# Altium schematic sheet Hardwiring.SchDoc
size 594 x 420 mm; Address1: Address1; Address2: Address2; Address3: Address3; Address4: Address4; DocumentNumber: *Э3; SheetNumber: 10; SheetTotal: 11; DocumentType: Схема электрическая *
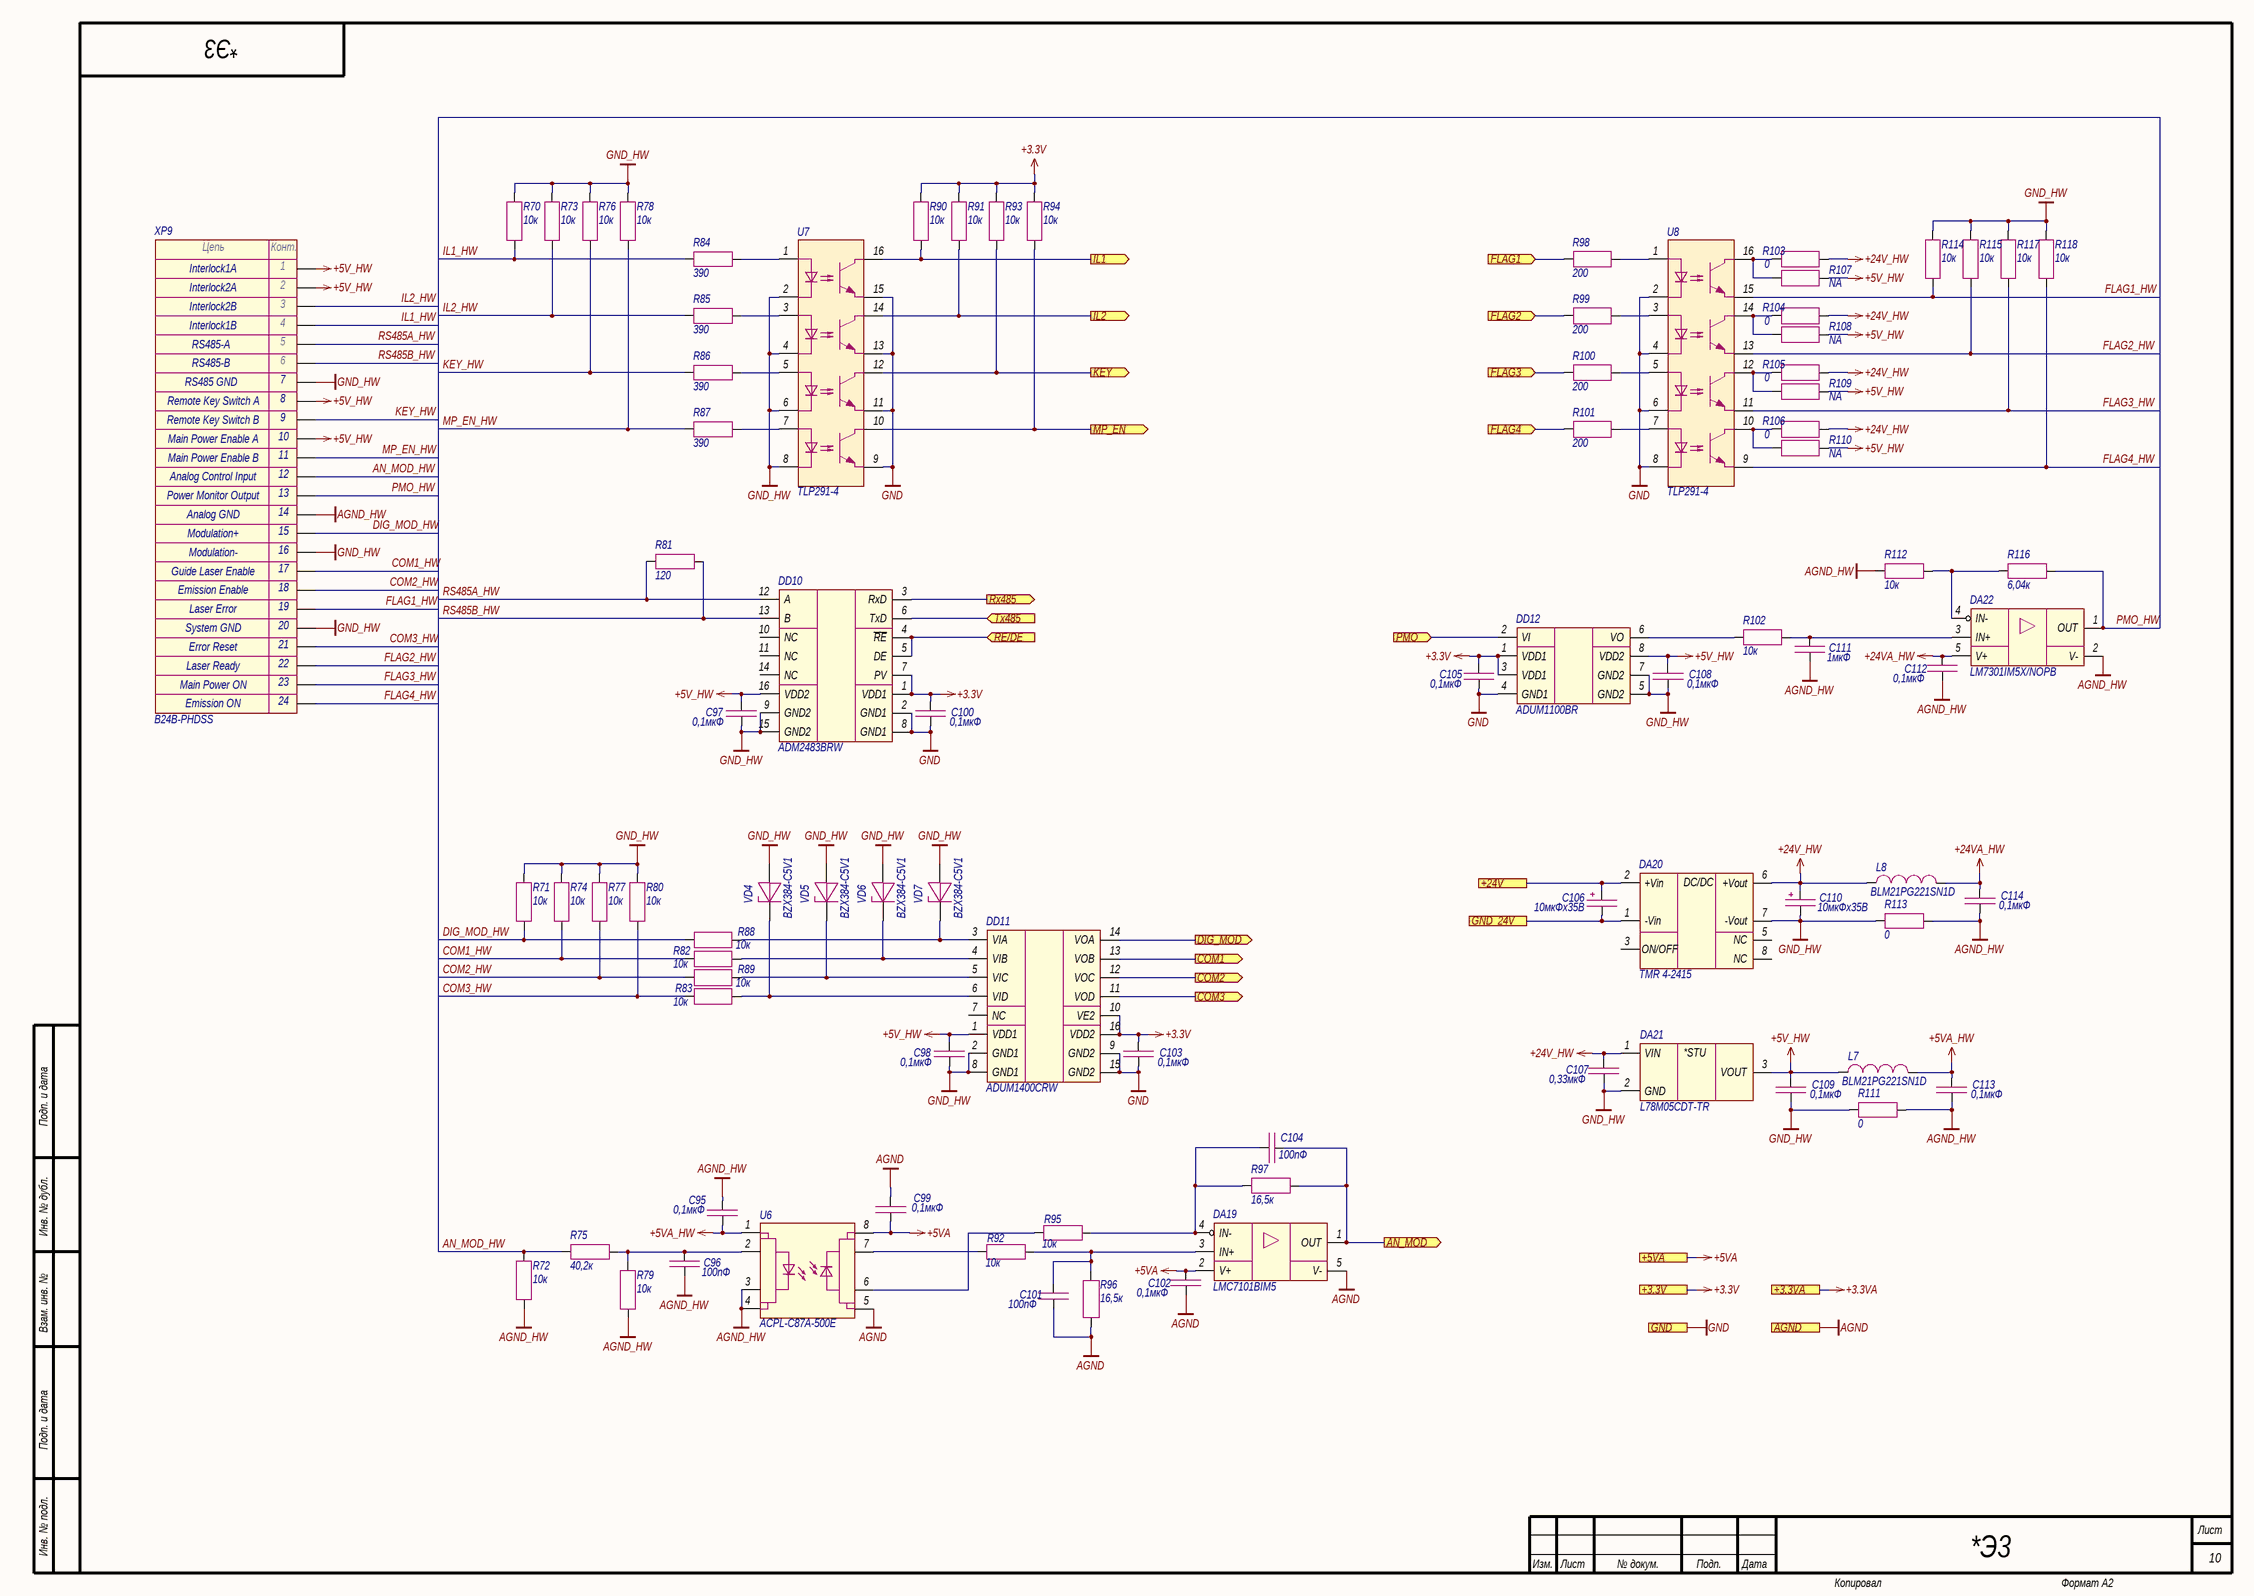
[diagram p0: Hardwiring.SchDoc]

## Parts
C95  0,1мкФ  [CAP_0603]
C96  100пФ  [CAP_0603]
C97  0,1мкФ  [CAP_0603]
C98  0,1мкФ  [CAP_0603]
C99  0,1мкФ  [CAP_0603]
C100  0,1мкФ  [CAP_0603]
C101  100пФ  [CAP_0603]
C102  0,1мкФ  [CAP_0603]
C103  0,1мкФ  [CAP_0603]
C104  100пФ  [CAP_0603]
C105  0,1мкФ  [CAP_0603]
C106  10мкФх35B  [CAP_C]
C107  0,33мкФ  [CAP_0805]
C108  0,1мкФ  [CAP_0603]
C109  0,1мкФ  [CAP_0603]
C110  10мкФх35B  [CAP_C]
C111  1мкФ  [CAP_0603]
C112  0,1мкФ  [CAP_0603]
C113  0,1мкФ  [CAP_0603]
C114  0,1мкФ  [CAP_0603]
DA19  LMC7101BIM5  [SOT-23-5]
DA20  TMR 4-2415  [TMR4 (SIP-8)]
DA21  L78M05CDT-TR  [TO-252]
DA22  LM7301IM5X/NOPB  [SOT-23-5]
DD10  ADM2483BRW  [SOIC-16W]
DD11  ADUM1400CRW  [SOIC-16W]
DD12  ADUM1100BR  [SOIC-8]
L7  BLM21PG221SN1D  [IND_0805]
L8  BLM21PG221SN1D  [IND_0805]
R70  10к  [RES_0603]
R71  10к  [RES_0603]
R72  10к  [RES_0603]
R73  10к  [RES_0603]
R74  10к  [RES_0603]
R75  40,2к  [RES_0603]
R76  10к  [RES_0603]
R77  10к  [RES_0603]
R78  10к  [RES_0603]
R79  10к  [RES_0603]
R80  10к  [RES_0603]
R81  120  [RES_0805]
R82  10к  [RES_0603]
R83  10к  [RES_0603]
R84  390  [RES_0603]
R85  390  [RES_0603]
R86  390  [RES_0603]
R87  390  [RES_0603]
R88  10к  [RES_0603]
R89  10к  [RES_0603]
R90  10к  [RES_0603]
R91  10к  [RES_0603]
R92  10к  [RES_0603]
R93  10к  [RES_0603]
R94  10к  [RES_0603]
R95  10к  [RES_0603]
R96  16,5к  [RES_0603]
R97  16,5к  [RES_0603]
R98  200  [RES_0603]
R99  200  [RES_0603]
R100  200  [RES_0603]
R101  200  [RES_0603]
R102  10к  [RES_0603]
R103  0  [RES_0603]
R104  0  [RES_0603]
R105  0  [RES_0603]
R106  0  [RES_0603]
R107  NA  [RES_0603]
R108  NA  [RES_0603]
R109  NA  [RES_0603]
R110  NA  [RES_0603]
R111  0  [RES_0805]
R112  10к  [RES_0603]
R113  0  [RES_0805]
R114  10к  [RES_0603]
R115  10к  [RES_0603]
R116  6,04к  [RES_0603]
R117  10к  [RES_0603]
R118  10к  [RES_0603]
U6  ACPL-C87A-500E  [SSO-8]
U7  TLP291-4  [SOP-16]
U8  TLP291-4  [SOP-16]
VD4  BZX384-C5V1  [SOD-323]
VD5  BZX384-C5V1  [SOD-323]
VD6  BZX384-C5V1  [SOD-323]
VD7  BZX384-C5V1  [SOD-323]
XP9  B24B-PHDSS  [B24B-PHDSS]

## Ports
+3.3V (see Main[3B], Ethernet[3D], Fiber_interlock[2C], Flow_sensor[2C], LD_driver[1D], Power_supply[1D]), +3.3VA (see Main[3B], LD_driver[1D], Photodiode[1C], Thermistor[2C]), +5VA (see Main[3B], LD_driver[1D], Photodiode[1C]), +24V (see Main[3B], Flow_sensor[2C], Indication[1C], LD_driver[1D], Power_supply[1D]), AGND (see Main[3B], LD_driver[1D], Photodiode[1D], Thermistor[2C]), AN_MOD (out, see Main[2B]), COM1 (out, see Main[2B]), COM2 (out, see Main[2B]), COM3 (out, see Main[2B]), DIG_MOD (out, see Main[2B]), FLAG1 (in, see Main[3B]), FLAG2 (in, see Main[3B]), FLAG3 (in, see Main[3B]), FLAG4 (in, see Main[3B]), GND (see Main[3B], Ethernet[3D], Fiber_interlock[2C], Flow_sensor[2C], Guide_laser[1C], Indication[1C], LD_driver[1D], Power_supply[1D]), GND_24V (see Main[3B], Flow_sensor[2C], Indication[1C], LD_driver[1D], Power_supply[1D]), IL1 (out, see Main[2B]), IL2 (out, see Main[2B]), KEY (out, see Main[2B]), MP_EN (out, see Main[2B]), PMO (in, see Main[3B]), RE/DE (in, see Main[2B]), Rx485 (out, see Main[2B]), Tx485 (in, see Main[2B])

## Nets
+3.3V: C100.1 C103.1 C105.1 DD10.1(VDD1) DD10.7(PV) DD11.10(VE2) DD11.16(VDD2) DD12.1(VDD1) DD12.3(VDD1) R90.1 R91.1 R93.1 R94.1 ; port +3.3V
+3.3VA: port +3.3VA
+5V_HW: C97.1 C98.1 C108.1 C109.1 DA21.3(VOUT) DD10.16(VDD2) DD11.1(VDD1) DD12.8(VDD2) L7.1 R107.2 R108.2 R109.2 R110.2 XP9.1 XP9.2 XP9.8 XP9.10
+5VA: C99.1 C102.1 DA19.2(V+) U6.8(VDD2) ; port +5VA
+5VA_HW: C95.1 C113.1 L7.2 U6.1(VDD1)
+24V_HW: C107.2 C110.1 DA20.6(+Vout) DA21.1(VIN) L8.1 R103.2 R104.2 R105.2 R106.2
+24VA_HW: C112.1 C114.1 DA22.5(V+) L8.2
AGND: C99.2 C101.2 C102.2 DA19.5(V-) R96.2 U6.5(GND2) ; port AGND
AGND_HW: C95.2 C96.1 C111.2 C112.2 C113.2 C114.2 DA22.2(V-) R72.2 R79.2 R111.2 R112.1 R113.2 U6.3(SHDN) U6.4(GND1) XP9.14
GND: C100.2 C103.2 C105.2 DD10.2(GND1) DD10.8(GND1) DD11.9(GND2) DD11.15(GND2) DD12.4(GND1) U7.9 U7.11 U7.13 U7.15 U8.2 U8.4 U8.6 U8.8 ; port GND
GND_HW: C97.2 C98.2 C107.1 C108.2 C109.2 C110.2 DA20.7(-Vout) DA21.2(GND) DD10.9(GND2) DD10.15(GND2) DD11.2(GND1) DD11.8(GND1) DD12.5(GND2) DD12.7(GND2) R70.1 R71.1 R73.1 R74.1 R76.1 R77.1 R78.1 R80.1 R111.1 R113.1 R114.1 R115.1 R117.1 R118.1 U7.2 U7.4 U7.6 U7.8 VD4.2(A) VD5.2(A) VD6.2(A) VD7.2(A) XP9.7 XP9.16 XP9.20
+24V: C106.1 DA20.2(+Vin) ; port +24V
AN_MOD: C104.2 DA19.1(OUT) R97.1 ; port AN_MOD
AN_MOD_HW: R72.1 R75.2 XP9.12
COM1: DD11.13(VOB) ; port COM1
COM1_HW: R74.2 R82.1 XP9.17
COM2: DD11.12(VOC) ; port COM2
COM2_HW: R77.2 R89.1 XP9.18
COM3: DD11.11(VOD) ; port COM3
COM3_HW: R80.2 R83.1 XP9.21
DIG_MOD: DD11.14(VOA) ; port DIG_MOD
DIG_MOD_HW: R71.2 R88.1 XP9.15
FLAG1: R98.2 ; port FLAG1
FLAG1_HW: R114.2 U8.15 XP9.19
FLAG2: R99.2 ; port FLAG2
FLAG2_HW: R115.2 U8.13 XP9.22
FLAG3: R100.2 ; port FLAG3
FLAG3_HW: R117.2 U8.11 XP9.23
FLAG4: R101.2 ; port FLAG4
FLAG4_HW: R118.2 U8.9 XP9.24
GND_24V: C106.2 DA20.1(-Vin) ; port GND_24V
IL1: R90.2 U7.16 ; port IL1
IL1_HW: R70.2 R84.1 XP9.4
IL2: R91.2 U7.14 ; port IL2
IL2_HW: R73.2 R85.1 XP9.3
KEY: R93.2 U7.12 ; port KEY
KEY_HW: R76.2 R86.1 XP9.9
MP_EN: R94.2 U7.10 ; port MP_EN
MP_EN_HW: R78.2 R87.1 XP9.11
PMO: DD12.2(VI) ; port PMO
PMO_HW: DA22.1(OUT) R116.2 XP9.13
RE/DE: DD10.4(~{RE}) DD10.5(DE) ; port RE/DE
RS485A_HW: DD10.12(A) R81.1 XP9.5
RS485B_HW: DD10.13(B) R81.2 XP9.6
Rx485: DD10.3(RxD) ; port Rx485
Tx485: DD10.6(TxD) ; port Tx485
NetC96_2: C96.2 R75.1 R79.1 U6.2(VIN)
NetC101_1: C101.1 DA19.3(IN+) R92.2 R96.1
NetC104_1: C104.1 DA19.4(IN-) R95.2 R97.2
NetC111_1: C111.1 DA22.3(IN+) R102.2
NetDA22_4: DA22.4(IN-) R112.2 R116.1
NetDD11_3: DD11.3(VIA) R88.2 VD7.1(K)
NetDD11_4: DD11.4(VIB) R82.2 VD6.1(K)
NetDD11_5: DD11.5(VIC) R89.2 VD5.1(K)
NetDD11_6: DD11.6(VID) R83.2 VD4.1(K)
NetDD12_6: DD12.6(VO) R102.1
NetR84_2: R84.2 U7.1
NetR85_2: R85.2 U7.3
NetR86_2: R86.2 U7.5
NetR87_2: R87.2 U7.7
NetR92_1: R92.1 U6.7(VOUT+)
NetR95_1: R95.1 U6.6(VOUT-)
NetR98_1: R98.1 U8.1
NetR99_1: R99.1 U8.3
NetR100_1: R100.1 U8.5
NetR101_1: R101.1 U8.7
NetR103_1: R103.1 R107.1 U8.16
NetR104_1: R104.1 R108.1 U8.14
NetR105_1: R105.1 R109.1 U8.12
NetR106_1: R106.1 R110.1 U8.10

Not connected (* = marked no-connect by the designer): DA20 3(ON/OFF) 5(NC) 8(NC); DD10 10(NC) 11(NC) 14(NC); DD11 7(NC)

## Notes on the sheet
- Interlock1A
- Interlock2A
- Interlock2B
- RS485-A
- RS485-B
- Interlock1B
- RS485 GND
- (near XP9) Remote Key Switch A
- (near XP9) Remote Key Switch B
- (near XP9) Main Power Enable A
- (near XP9) Main Power Enable B
- (near XP9) Analog Control Input
- (near XP9) Power Monitor Output
- Analog GND
- Modulation+
- Modulation-
- (near XP9) Guide Laser Enable
- (near XP9) Emission Enable
- System GND
- Error Reset
- Laser Error
- Main Power ON
- Emission ON
- Laser Ready
- Подп. и дата
- Инв. № дубл.
- Взам. инв. №
- Инв. № подл.
- Изм.
- Лист
- № докум.
- Подп.
- Дата
- Копировал
- Формат А2
- (in symbol Connector-24) Цепь; Конт.
- (in symbol L78M) *STU
- (in symbol TMR4) DC/DC

## Library data of the parts
C95 C97-C100 C102 C103 C105 C108 C109 C112-C114 = Capacitor: Manufacturer: Murata; Model: GRM188R71H104KA93D; Value: 0,1мкФ; Document: *
C96 C101 C104 = Capacitor: Manufacturer: Murata; Model: GRM1885C1H101JA01D; Value: 100пФ; Document: *
C106 C110 = Capacitor_Polar: Model: TECAP, 10 мкФ, 35 В, тип C, 10%; Value: 10мкФх35B; Document: *; Manufacturer: *
C107 = Capacitor: Manufacturer: Murata; Model: GRM219R71H334KA88D; Value: 0,33мкФ; Document: *
C111 = Capacitor: Manufacturer: Murata; Model: GRM188R61H105KAALD; Value: 1мкФ; Document: *
DA19 = LMC7101: Manufacturer: Texas Instruments; Model: LMC7101BIM5; Document: *
DA20 = TMR4: Manufacturer: Traco Power; Model: TMR 4-2415; Document: *
DA21 = L78M: Manufacturer: STMicroelectronics; Model: L78M05CDT-TR; Document: *
DA22 = LM7301IM5: Manufacturer: Texas Instruments; Model: LM7301IM5X/NOPB; Document: *
DD10 = ADM2483BRW: Manufacturer: Analog Devices; Model: ADM2483BRW; Document: *
DD11 = ADUM1400: Manufacturer: Analog Devices; Model: ADUM1400CRW; Document: *
DD12 = ADUM1100: Manufacturer: Analog Devices; Model: ADUM1100BR; Document: *
L7 L8 = Inductor: Manufacturer: Murata; Value: *; Model: BLM21PG221SN1D; Document: *
R70-R74 R76-R80 R82 R83 R88-R95 R102 R112 R114 R115 R117 R118 = Resistor: Manufacturer: Yageo; Model: RC0603FR-0710KL; Value: 10к; Document: *
R75 = Resistor: Manufacturer: Yageo; Model: RC0603FR-0740K2L; Value: 40,2к; Document: *
R81 = Resistor: Manufacturer: Yageo; Model: RC0805FR-07120RL; Value: 120; Document: *
R84-R87 = Resistor: Manufacturer: Yageo; Model: RC0603FR-07390RL; Value: 390; Document: *
R96 R97 = Resistor: Manufacturer: Yageo; Model: RC0603FR-0716K5L; Value: 16,5к; Document: *
R98-R101 = Resistor: Manufacturer: Yageo; Model: RC0603FR-07200RL; Value: 200; Document: *
R103-R106 = Resistor: Manufacturer: Yageo; Model: RC0603FR-070RL; Value: 0; Document: *
R107-R110 = Resistor: Value: NA; Model: *; Document: *; Manufacturer: *
R111 R113 = Resistor: Manufacturer: Yageo; Model: RC0805FR-070RL; Value: 0; Document: *
R116 = Resistor: Manufacturer: Yageo; Model: RC0603FR-076K04L; Value: 6,04к; Document: *
U6 = ACPL-C87: Manufacturer: Broadcom; Model: ACPL-C87A-500E
U7 U8 = TLP281-4: Manufacturer: Toshiba; Model: TLP291-4; Document: *
VD4-VD7 = Diode_Zener: Manufacturer: Nexperia; Model: BZX384-C5V1; Document: *
XP9 = Connector-24: Manufacturer: JST; Model: B24B-PHDSS; Document: *